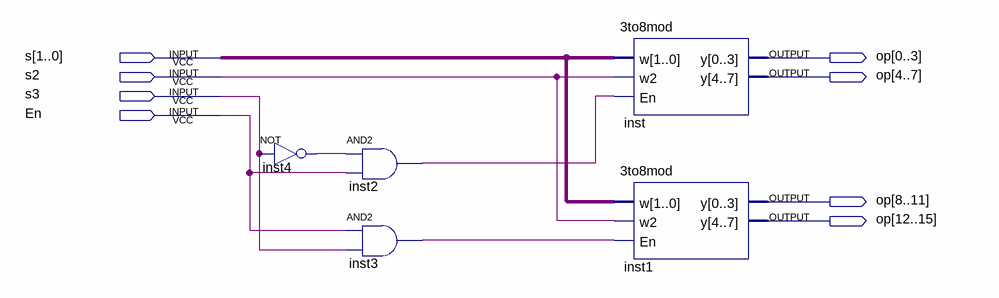
[diagram p0: schematic sheet]
// Quartus schematic dec4to16.bdf as structural Verilog: 5 symbols, 8 pins
module dec4to16 (
  input  [1:0] s,
  input  s2,
  input  s3,
  input  En,
  output [0:15] op
);

  wire inst2_out, inst3_out, inst4_out;

  not inst4 (inst4_out, s3);
  and inst2 (inst2_out, inst4_out, En);
  and inst3 (inst3_out, En, s3);
  \3to8mod  inst (.w(s), .w2(s2), .En(inst2_out), .y({op[7], op[6], op[5], op[4], op[3], op[2], op[1], op[0]}));
  \3to8mod  inst1 (.w(s), .w2(s2), .En(inst3_out), .y({op[15], op[14], op[13], op[12], op[11], op[10], op[9], op[8]}));
endmodule
